# Altium schematic sheet Electrode.SchDoc
size 177 x 109 mm; Author: Rishabh Jain; DrawnBy: Rishabh Jain; Revision: 1.0; SheetNumber: 2; SheetTotal: 2
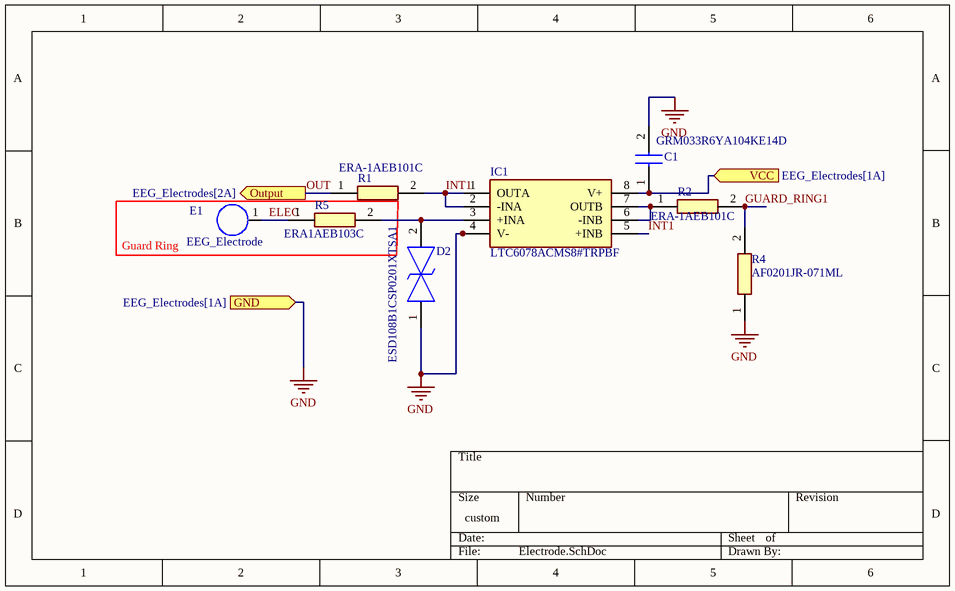
[diagram p0: Electrode.SchDoc]

## Parts
C1  GRM033R6YA104KE14D  [CAPC0603X33N]
D2  ESD108B1CSP0201XTSA1  [ESD108B1CSP0201XTSA1]
E1  EEG_Electrode  [EEG_Electrode]
IC1  LTC6078ACMS8#TRPBF  [SOP65P490X110-8N]
R1  ERA-1AEB101C  [ERA1A_(0201)]
R2  ERA-1AEB101C  [ERA1A_(0201)]
R4  AF0201JR-071ML  [ERA1A_(0201)]
R5  ERA1AEB103C  [ERA1A_(0201)]

## Blocks framed on the sheet
Guard Ring: E1 R5

## Ports
GND (in, see EEG_Electrodes[1A]), Output (out, see EEG_Electrodes[2A]), VCC (in, see EEG_Electrodes[1A])

## Nets
GND: C1.2 D2.1 IC1.4(V-) R4.1 ; port GND
ELEC: E1.1 R5.1
GUARD_RING1: R2.2 R4.2
INT1: IC1.1(OUTA) IC1.2(-INA) IC1.5(+INB) R1.2
OUT: R1.1 ; port Output
VCC: C1.1 IC1.8(V+) ; port VCC
NetD2_2: D2.2 IC1.3(+INA) R5.2
NetIC1_6: IC1.6(-INB) IC1.7(OUTB) R2.1

## Library data of the parts
C1 = GRM033R6YA104KE14D: Capacitor 0.1uF 0201; Manufacturer_Name: Murata Electronics; Datasheet Link: https://search.murata.co.jp/Ceramy/image/img/A01X/G101/ENG/GRM033R6YA104KE14-01A.pdf; Height: 0.33mm; Manufacturer_Part_Number: GRM033R6YA104KE14D; Mouser Part Number: 81-GRM33R6YA104KE14D; Mouser Price/Stock: https://www.mouser.co.uk/ProductDetail/Murata-Electronics/GRM033R6YA104KE14D?qs=P%2FC4Eoq9CDwTt3wOuyKhXw%3D%3D; Arrow Part Number: GRM033R6YA104KE14D; Arrow Price/Stock: https://www.arrow.com/en/products/grm033r6ya104ke14d/murata-manufacturing?utm_currency=USD&region=europe
D2 = ESD108B1CSP0201XTSA1: TVS Diode (Bi-directional); Manufacturer_Name: Infineon; Datasheet Link: https://www.infineon.com/dgdl/Infineon-ESD108-B1-CSP0201-DS-v01_00-EN.pdf?fileId=5546d4624b0b249c014b1746e4d05aa8; Height: 0.16mm; Manufacturer_Part_Number: ESD108B1CSP0201XTSA1; Mouser Part Number: 726-ESD108B1CSP0201X; Mouser Price/Stock: https://www.mouser.co.uk/ProductDetail/Infineon-Technologies/ESD108B1CSP0201XTSA1?qs=3Bi3m9r5MQZFyNTZtNMRAQ%3D%3D; Arrow Part Number: ESD108B1CSP0201XTSA1; Arrow Price/Stock: https://www.arrow.com/en/products/esd108b1csp0201xtsa1/infineon-technologies-ag?region=nac
IC1 = LTC6078ACMS8#TRPBF: Integrated Circuit; Manufacturer_Name: Analog Devices; Datasheet Link: https://datasheet.datasheetarchive.com/originals/distributors/Datasheets_SAMA/f60955edb7006695a84935bb44c6cde2.pdf; Height: 1.1mm; Manufacturer_Part_Number: LTC6078ACMS8#TRPBF; Mouser Part Number: 584-C6078ACMS8TRPBF; Mouser Price/Stock: https://www.mouser.com/Search/Refine.aspx?Keyword=584-C6078ACMS8TRPBF; Arrow Part Number: LTC6078ACMS8#TRPBF; Arrow Price/Stock: https://www.arrow.com/en/products/ltc6078acms8trpbf/analog-devices?region=nac
R1 R2 = ERA-1AEB101C: Resistor 100 ohms; Manufacturer_Name: Panasonic; Datasheet Link: http://industrial.panasonic.com/cdbs/www-data/pdf/RDM0000/AOA0000C307.pdf; Height: 0.26mm; Manufacturer_Part_Number: ERA-1AEB101C; Mouser Part Number: 667-ERA-1AEB101C; Mouser Price/Stock: https://www.mouser.co.uk/ProductDetail/Panasonic/ERA-1AEB101C?qs=6%252Bc%252B2ke79U4NC8Nf%252Bq1i6A%3D%3D; Arrow Part Number: ERA-1AEB101C; Arrow Price/Stock: https://www.arrow.com/en/products/era-1aeb101c/panasonic?region=nac
R4 = ERA-1AEB101C: Resistor 1M; Manufacturer_Name: Panasonic; Datasheet Link: http://industrial.panasonic.com/cdbs/www-data/pdf/RDM0000/AOA0000C307.pdf; Height: 0.26mm; Manufacturer_Part_Number: ERA-1AEB101C; Mouser Part Number: 667-ERA-1AEB101C; Mouser Price/Stock: https://www.mouser.co.uk/ProductDetail/Panasonic/ERA-1AEB101C?qs=6%252Bc%252B2ke79U4NC8Nf%252Bq1i6A%3D%3D; Arrow Part Number: ERA-1AEB101C; Arrow Price/Stock: https://www.arrow.com/en/products/era-1aeb101c/panasonic?region=nac
R5 = ERA1AEB103C: Resistor 10k; Manufacturer_Name: Panasonic; Datasheet Link: http://industrial.panasonic.com/cdbs/www-data/pdf/RDM0000/AOA0000C307.pdf; Height: 0.26mm; Manufacturer_Part_Number: ERA1AEB103C